# Altium schematic sheet mcs4.SchDoc
size A4
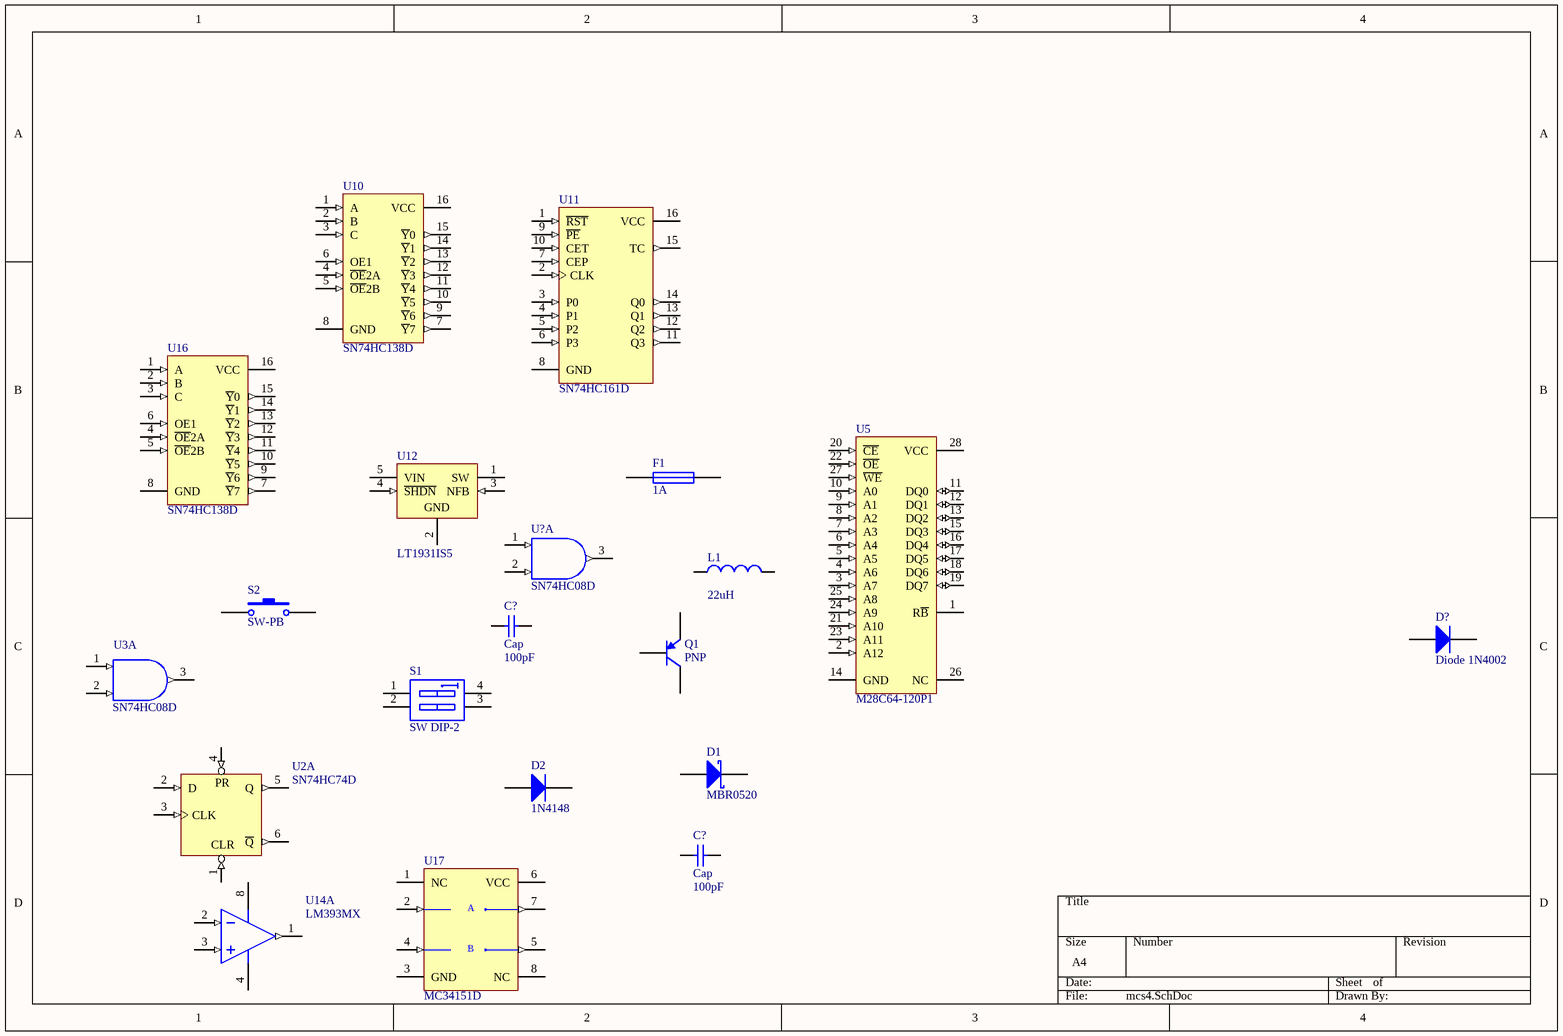
[diagram p0: mcs4.SchDoc]

## Parts
(Parts that share a designator on the sheet are numbered #1, #2 ... from top to bottom, then left to right.)
C?#1  Cap  value 100pF  [RAD-0.3]
C?#2  Cap  value 100pF  [RAD-0.3]
D1  MBR0520  [SMB]
D2  1N4148  [DO-35]
D?  Diode 1N4002  [DO-41]
F1  1A  [PIN-W2/E2.8]
L1  value 22uH  [0402-A]  (hidden comment: Inductor)
Q1  PNP  [SOT-23B_N]
S1  SW DIP-2  [DIP-4]
S2  SW-PB  [SPST-2]
U2  SN74HC74D  [D014_N]  (part A of 2)
U3  SN74HC08D  [D014_N]  (part A of 4)
U5  M28C64-120P1  [PDIP28]
U10  SN74HC138D  [D016_N]
U11  SN74HC161D  [D016_N]
U12  LT1931IS5  [S5-T_N]
U14  LM393MX  [M08A_N]  (part A of 2)
U16  SN74HC138D  [D016_N]
U17  MC34151D  [751-06_N]
U?  SN74HC08D  [D014_N]  (part A of 4)

## Nets
GND: U2.7(GND) U3.7(GND) U?.7(GND)
VCC: U2.14(VCC) U3.14(VCC) U?.14(VCC)

Not connected (* = marked no-connect by the designer): C?#1 1 2; C?#2 1 2; D1 1(A) 2(K); D2 1(A) 2(K); D? 1(A) 2(K); F1 1 2; L1 1 2; Q1 1(C) 2(B) 3(E); S1 1(A1) 2(A2) 3(B2) 4(B1); S2 1 2; U2 1(CLR) 2(D) 3(CLK) 4(PR) 5(Q) 6(~{Q}); U3 1(A) 2(B) 3(Y); U5 1(R~{B}) 2(A12) 3(A7) 4(A6) 5(A5) 6(A4) 7(A3) 8(A2) 9(A1) 10(A0) 11(DQ0) 12(DQ1) 13(DQ2) 14(GND) 15(DQ3) 16(DQ4) 17(DQ5) 18(DQ6) 19(DQ7) 20(~{CE}) 21(A10) 22(~{OE}) 23(A11) 24(A9) 25(A8) 26(NC) 27(~{WE}) 28(VCC); U10 1(A) 2(B) 3(C) 4(~{OE}2A) 5(~{OE}2B) 6(OE1) 7(~{Y}7) 8(GND) 9(~{Y}6) 10(~{Y}5) 11(~{Y}4) 12(~{Y}3) 13(~{Y}2) 14(~{Y}1) 15(~{Y}0) 16(VCC); U11 1(~{RST}) 2(CLK) 3(P0) 4(P1) 5(P2) 6(P3) 7(CEP) 8(GND) 9(~{PE}) 10(CET) 11(Q3) 12(Q2) 13(Q1) 14(Q0) 15(TC) 16(VCC); U12 1(SW) 2(GND) 3(NFB) 4(~{SHDN}) 5(VIN); U14 1(OUTA) 2(INA-) 3(INA+) 4(GND) 8(V+); U16 1(A) 2(B) 3(C) 4(~{OE}2A) 5(~{OE}2B) 6(OE1) 7(~{Y}7) 8(GND) 9(~{Y}6) 10(~{Y}5) 11(~{Y}4) 12(~{Y}3) 13(~{Y}2) 14(~{Y}1) 15(~{Y}0) 16(VCC); U17 1(NC) 2(INA) 3(GND) 4(INB) 5(~{OUTB}) 6(VCC) 7(~{OUTA}) 8(NC); U? 1(A) 2(B) 3(Y)

## Notes on the sheet
- (in symbol MC34151D) A; B

## Library data of the parts
C?#1 C?#2 = Cap: Capacitor; Published: 8-Jun-2000; LatestRevisionDate: 17-Jul-2002; LatestRevisionNote: Re-released for DXP Platform.; PackageReference: RAD-0.3; Publisher: Altium Limited; PackageDescription: Radial Cap, Thru-Hole; 2 Leads; 0.3 in Pin Spacing
D1 = D Schottky: Published: 8-Jun-2000; LatestRevisionDate: 17-Jul-2002; LatestRevisionNote: Re-released for DXP Platform.; PackageReference: SMB; Publisher: Altium Limited; PackageDescription: DO-214-AA/SMB; 2 C-Bend Leads; Body 5.3 x 3.6 mm, inc. leads (LxW); Code_JEDEC: DO-214-AA
D2 = 1N4148: High Conductance Fast Diode; Published: 8-Jun-2000; LatestRevisionDate: 17-Jul-2002; LatestRevisionNote: Re-released for DXP Platform.; DatasheetDocument: 1997; PackageReference: DO-35; Publisher: Altium Limited; Code_JEDEC: DO-204-AH; ComponentLink1Description: Manufacturer Link; ComponentLink1URL: http://www.fairchildsemi.com/; ComponentLink2Description: Datasheet; ComponentLink2URL: http://www.fairchildsemi.com/ds/1N%2F1N4148.pdf
D? = Diode 1N4002: 1 Amp General Purpose Rectifier; Published: 8-Jun-2000; LatestRevisionDate: 17-Jul-2002; LatestRevisionNote: Re-released for DXP Platform.; DatasheetVersion: 1998; PackageVersion: Aug-1999; PackageReference: DO-41; Publisher: Altium Limited; PackageDescription: Diode, Axial; Body 5.2 x 2.7 mm (LxDia. max), Lead Dia. 0.86 mm (max); Code_JEDEC: DO-204-AL; ComponentLink1Description: Manufacturer Link; ComponentLink1URL: http://www.fairchildsemi.com/; ComponentLink2Description: Datasheet; ComponentLink2URL: http://www.fairchildsemi.com/ds/1N%2F1N4001.pdf
F1 = Fuse 1: Fuse; Published: 8-Jun-2000; LatestRevisionDate: 17-Jul-2002; LatestRevisionNote: Re-released for DXP Platform.; PackageReference: PIN-W2/E2.8; Publisher: Altium Limited; PackageDescription: Thru-Hole; 2 Leads
L1 = Inductor: Code_IEC: 1005; Published: 8-Jun-2000; LatestRevisionDate: 29-May-2009; LatestRevisionNote: IPC-7351 Footprint Added.; PackageReference: 0402-A; Publisher: Altium Limited; PackageDescription: Chip Inductor; Code_JEITA: 0402
Q1 = PNP: PNP Bipolar Transistor; Published: 8-Jun-2000; LatestRevisionDate: 29-May-2009; LatestRevisionNote: IPC-7351 Footprint Added.; PackageVersion: Aug-1999; PackageReference: SOT-23B; Publisher: Altium Limited; PackageDescription: 3-Pin SOT-23 Package 0.95 mm Pitch, 2.4 mm Lead Span
S1 = SW DIP-2: DIP Switch, 2 Position, SPST; Published: 24-Mar-1999; LatestRevisionDate: 17-Jul-2002; LatestRevisionNote: Re-released for DXP Platform.; PackageReference: DIP-4; Publisher: Altium Limited
S2 = SW-PB: Switch; Published: 24-Mar-1999; LatestRevisionDate: 17-Jul-2002; LatestRevisionNote: Re-released for DXP Platform.; PackageReference: SPST-2; Publisher: Altium Limited; PackageDescription: Switch; 2 Leads
U2 = SN74HC74D: Dual D-Type Positive-Edge-Triggered Flip-Flop with Clear and Preset; Published: 8-Jun-2000; LatestRevisionDate: 13-Apr-2006; LatestRevisionNote: IPC-7351 Footprint Added.; DatasheetVersion: May-1997; PackageVersion: Jan-1998; PackageReference: D014; Publisher: Altium Limited; PackageDescription: 14-Pin Small Outline Integrated Circuit 1.27 mm Pitch; Code_IPC: SOIC127P600-14; ComponentLink1Description: Manufacturer Link; ComponentLink1URL: http://www.ti.com/; ComponentLink2Description: Datasheet; ComponentLink2URL: http://www-s.ti.com/sc/ds/sn74hc74.pdf
U3 U? = SN74HC08D: Quadruple 2-Input Positive-AND Gate; Published: 8-Jun-2000; LatestRevisionDate: 13-Apr-2006; LatestRevisionNote: IPC-7351 Footprint Added.; DatasheetVersion: May-1997; PackageVersion: Jan-1998; PackageReference: D014; Publisher: Altium Limited; PackageDescription: 14-Pin Small Outline Integrated Circuit 1.27 mm Pitch; Code_IPC: SOIC127P600-14; ComponentLink1Description: Manufacturer Link; ComponentLink1URL: http://www.ti.com/; ComponentLink2Description: Datasheet; ComponentLink2URL: http://www-s.ti.com/sc/ds/SN74HC08.pdf
U5 = M28C64-120P1: Parallel 64 Kbit (8K x 8) EEPROM with Software Data Protection; Published: 24-Aug-2001; LatestRevisionDate: 06-Jun-2005; LatestRevisionNote: Stylized 3D Model Added.; DatasheetVersion: Jun-1996; PackageVersion: Jan-2003; PackageReference: PDIP28; Publisher: Altium Limited; PackageDescription: DIP; 28 Leads; Row Spacing 15.24 mm; Pitch 2.54 mm; ComponentLink1Description: Manufacturer Link; ComponentLink1URL: http://www.st.com/
U10 U16 = SN74HC138D: 3-Line to 8-Line Decoder / Demultiplexer; Published: 8-Jun-2000; LatestRevisionDate: 13-Apr-2006; LatestRevisionNote: IPC-7351 Footprint Added.; DatasheetVersion: May-1997; PackageVersion: Jan-1998; PackageReference: D016; Publisher: Altium Limited; PackageDescription: 16-Pin Small Outline Integrated Circuit 1.27 mm Pitch; Code_IPC: SOIC127P600-16; ComponentLink1Description: Manufacturer Link; ComponentLink1URL: http://www.ti.com/; ComponentLink2Description: Datasheet; ComponentLink2URL: http://www-s.ti.com/sc/ds/sn74hc138.pdf
U11 = SN74HC161D: 4-Bit Synchronous Binary Counter; Published: 8-Jun-2000; LatestRevisionDate: 13-Apr-2006; LatestRevisionNote: IPC-7351 Footprint Added.; DatasheetVersion: May-1997; PackageVersion: Jan-1998; PackageReference: D016; Publisher: Altium Limited; PackageDescription: 16-Pin Small Outline Integrated Circuit 1.27 mm Pitch; Code_IPC: SOIC127P600-16; ComponentLink1Description: Manufacturer Link; ComponentLink1URL: http://www.ti.com/; ComponentLink2Description: Datasheet; ComponentLink2URL: http://www-s.ti.com/sc/ds/sn74hc161.pdf
U12 = LT1931IS5: 1.2MHz Inverting Current Mode DC/DC Converter; Note: 1635; Published: 6-Jun-2005; LatestRevisionDate: 29-May-2009; LatestRevisionNote: IPC-7351 Footprint Added.; DatasheetVersion: Jun-2001; PackageVersion: 2005; PackageReference: S5-T; Publisher: Altium Limited; PackageDescription: 5-Pin SOT-23 Package 0.95 mm Pitch, 2.8 mm Lead Span; Code_IPC: SOT23-5; ComponentLink1Description: Manufacturer Link; ComponentLink1URL: http://www.linear.com/; ComponentLink2Description: Datasheet; ComponentLink2URL: http://www.linear.com/pc/downloadDocument.do?navId=H0,C1,C1003,C1042,P1863,D3921
U14 = LM393MX: Low Power Low Offset Voltage Dual Comparator; Manufacturer: National Semiconductor; PackageTopMarking: NSZXTT*LM*393M; Published: 4-Dec-2008; DatasheetVersion: Aug-2002; PackageVersion: revL, Sep-2006; PackageReference: M08A; Publisher: Altium Limited; PackageDescription: SOIC Narrow, 4.9 x 3.9 x 1.45mm, 8 Lead, 1.27mm Pitch; CompType: Comparator; PartNumber: LM393MX; RoHS: O; PinCount: 8; DigiKeyPartNumber: LM393MXCT-ND; Code_JEDEC: MS-012-AA; Code_IPC: SOIC127P600-8; ComponentLink1Description: LM393 Datasheet; ComponentLink1URL: http://www.national.com/ds/LM/LM393.pdf; ComponentLink2Description: LM393  Web Page; ComponentLink2URL: http://www.national.com/pf/LM/LM393.html; ComponentLink3Description: M08A Package Page; ComponentLink3URL: http://www.national.com/packaging/folders/m08a.html
U17 = MC34151D: High Speed Dual MOSFET Driver; Published: 17-Jul-2002; LatestRevisionDate: 13-Apr-2006; LatestRevisionNote: IPC-7351 Footprint Added.; DatasheetVersion: Apr-2000; PackageVersion: Sep-1999; PackageReference: 751-06; Publisher: Altium Limited; PackageDescription: 8-Pin Small Outline Integrated Circuit 1.27 mm Pitch; Code_JEDEC: MS-012-AA; Code_IPC: SOIC127P600-8; ComponentLink1Description: Manufacturer Link; ComponentLink1URL: http://www.onsemi.com/site/products/parametrics/0,4446,388,00.html; ComponentLink2Description: Datasheet; ComponentLink2URL: http://www.onsemi.com/pub/Collateral/MC34151-D.PDF